# Altium schematic sheet 3v3 Reg.SchDoc
size A; SheetNumber: 1; SheetTotal: 1
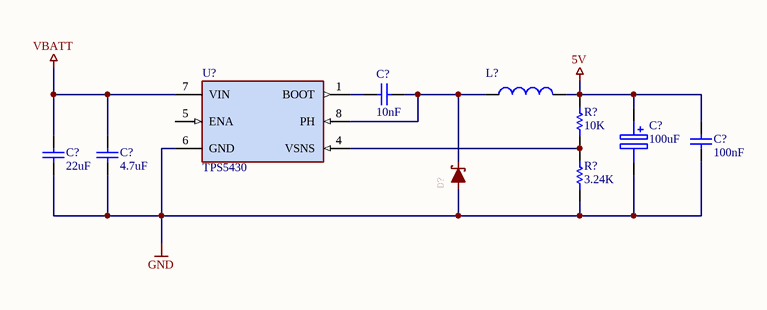
[diagram p0: 3v3 Reg.SchDoc]

## Parts
(Parts that share a designator on the sheet are numbered #1, #2 ... from top to bottom, then left to right.)
C?#1  10nF  [CAPC1608X90X35ML10T15]
C?#2  value 100uF  [CAPPM7344X310N]  (hidden comment: TAJE107M025RNJ)
C?#3  100nF  [CAPC1608X90X35ML10T15]
C?#4  22uF  [CAPC1608X90X35ML10T15]
C?#5  4.7uF  [CAPC1608X90X35ML10T15]
D?  DIODE-SCHOTTKY  [SMA-DIODE]  (value not drawn)
L?  10Uh  [SWPA8040]  (value not drawn)
R?#1  10K  [RESISTOR0603]
R?#2  3.24K  [RESISTOR0603]
U?  TPS5430  [FP-DDA0008J-MFG]

## Nets
5V: C?#2.1(+) C?#3.2 L?.P2 R?#1.2
GND: C?#2.2(-) C?#3.1 C?#4.1 C?#5.1 D?.A R?#2.1 U?.6(GND)
VBATT: C?#4.2 C?#5.2 U?.7(VIN)
NetC?#1_1: C?#1.1 D?.C L?.P1 U?.8(PH)
NetC?#1_2: C?#1.2 U?.1(BOOT)
NetR?#1_1: R?#1.1 R?#2.2 U?.4(VSNS)

Not connected (* = marked no-connect by the designer): U? 5(ENA)

## Library data of the parts
C?#1 = CMP-001-00002-4: CAP 10nF; Value: 10nF
C?#2 = CMP-092-000000-5: 25V 100UF ±20% TAJE107M025RNJ; Manufacturer_Part_Number: TAJD686K010R; Design Item ID: TAJD686K010R; Source: SamacSys.SchLib; Height: 3.1mm; Datasheet Link: http://datasheets.avx.com/TAJ.pdf
C?#3 = CMP-001-00005-1: CAP 100nF; Value: 100nF
C?#4 = CMP-001-00004-1: CAP 22uF; Value: 22uF
C?#5 = CMP-001-00003-2: CAP 4.7UF; Value: 4.7uF
D? = CMP-066-000000-2: Diode; GateName_1: G$1; Package: SMA-DIODE; DeviceSetName: DIODE-SCHOTTKY; Design Item ID: DIODE-SCHOTTKY; Source: JH.SCHLIB; LibraryName: JH; Component Type: Standard; Pin Count: 2; SymbolName_1: DIODE-SCHOTTKY
L? = CMP-068-000000-6: Inductor for 5V & 3.3V Buck; ComponentLink1URL: 10uH; ComponentLink1Description: Value
R?#1 = CMP-009-00000-2: RES 10K 0603; Value: 10K
R?#2 = CMP-009-00002-1: RES 3.24K 0603; Value: 3.24K
U? = CMP-071-000000-5: Step Down Converter; DeviceSetName: TPS54X0; GateName_1: G$1; Design Item ID: TPS54X0; LibraryName: JH; SymbolName_1: TPS54X0; Package: POWERPAD-SOIC-8; Pin Count: 7; Component Type: Standard